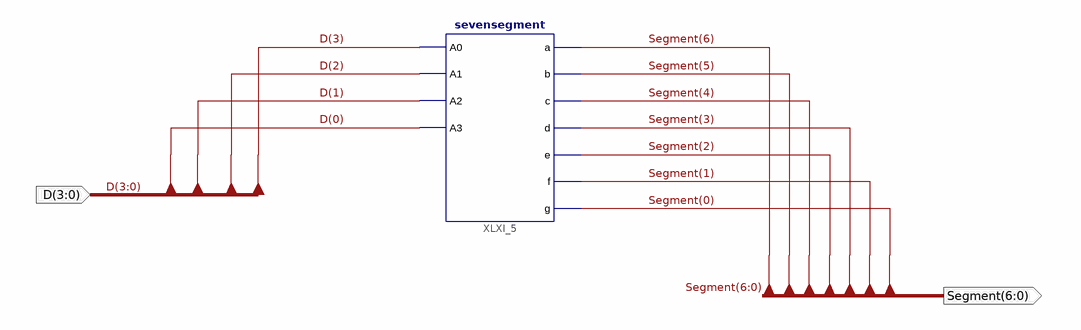
[diagram p0: schematic sheet 1]
// Xilinx ISE schematic BCDtosevensegment.sch (spartan6) as structural Verilog: 1 symbols, 2 ports
module BCDtosevensegment (
  input  [3:0] D,
  output [6:0] Segment
);

  sevensegment XLXI_5 (
    .a(Segment[6]), .A0(D[3]), .A1(D[2]), .A2(D[1]), .A3(D[0]), .b(Segment[5]), .c(Segment[4]),
    .d(Segment[3]), .e(Segment[2]), .f(Segment[1]), .g(Segment[0]));
endmodule
